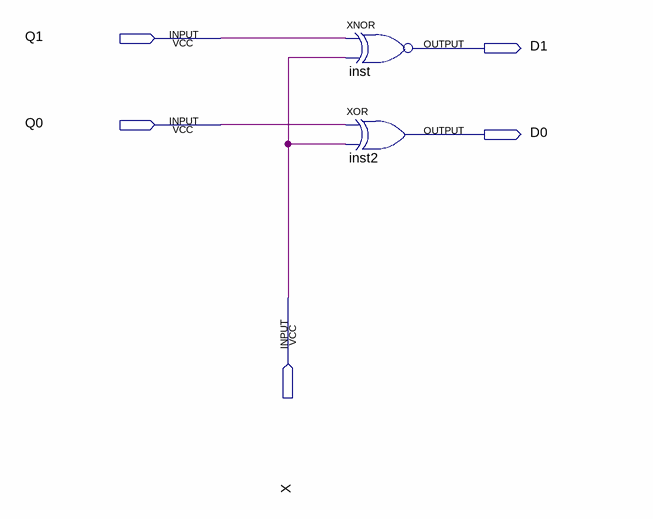
[diagram p0: schematic sheet]
// Quartus schematic MEFD.bdf as structural Verilog: 2 symbols, 5 pins
module MEFD (
  input  Q1,
  input  Q0,
  input  X,
  output D1,
  output D0
);

  xnor inst (D1, Q1, X);
  xor inst2 (D0, Q0, X);
endmodule
